# Altium schematic sheet AC6901Demo0.SchDoc
size A4; SheetNumber: 1; SheetTotal: 2
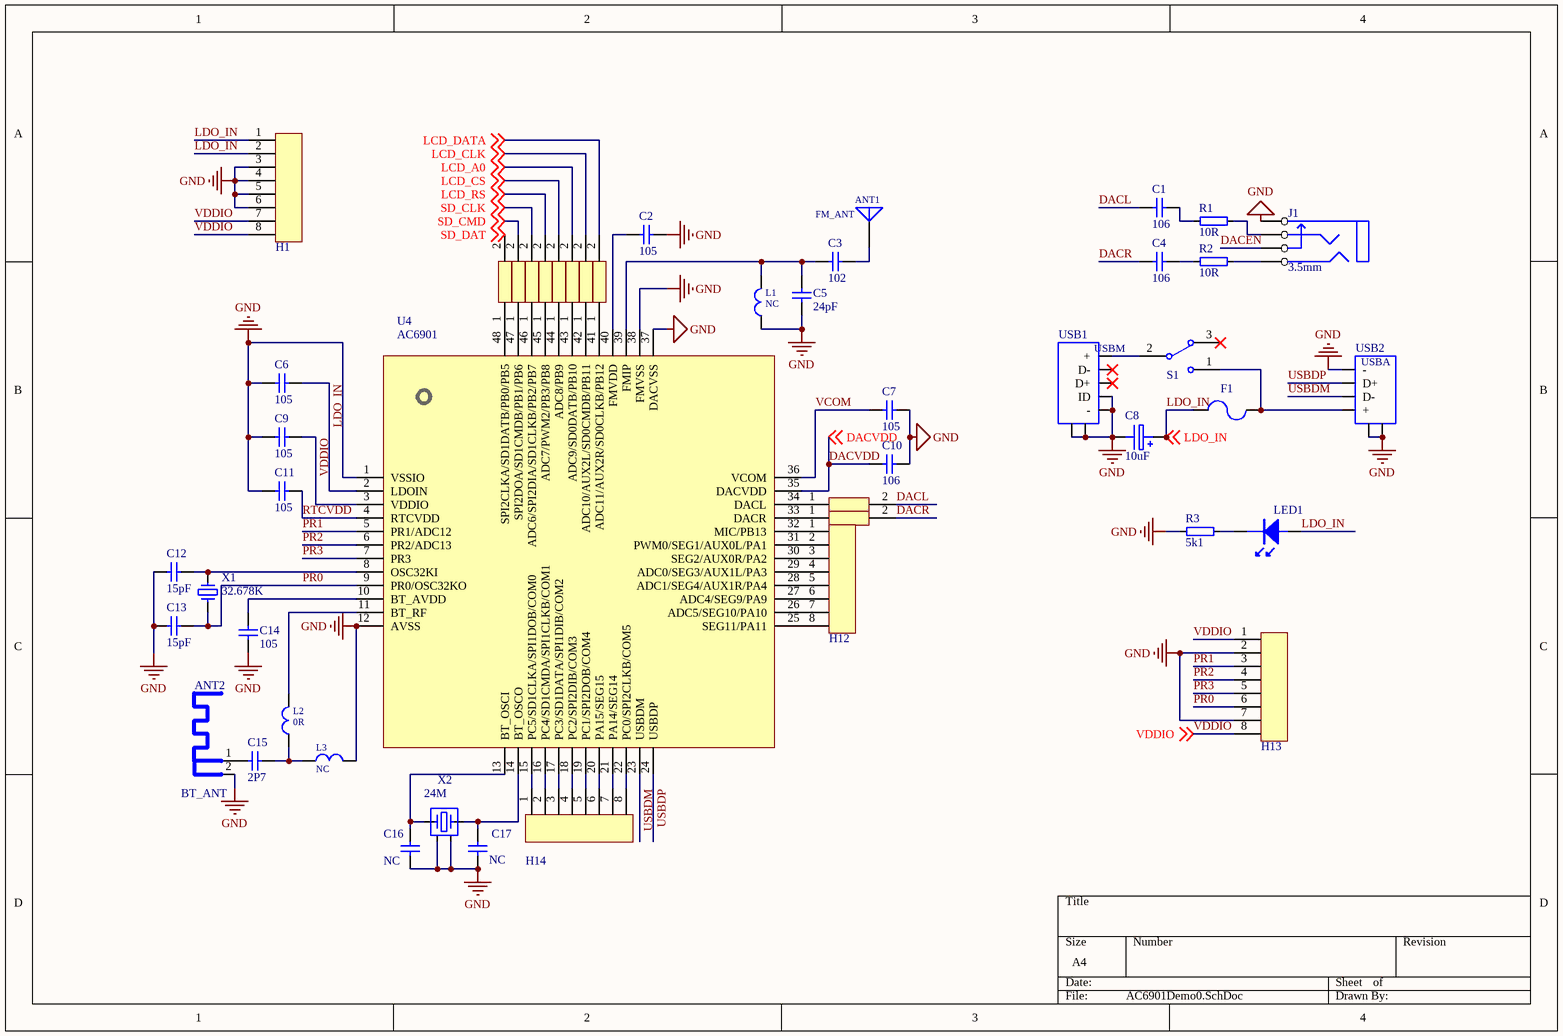
[diagram p0: AC6901Demo0.SchDoc]

## Parts
ANT1  FM_ANT  [FM_ANT]
ANT2  BT_ANT  [ANT-F-2-2.4G]
C1  106  [C 0805]
C2  105  [C 0805]
C3  102  [C 0805]
C4  106  [C 0805]
C5  24pF  [C 0805]
C6  105  [C 0805]
C7  105  [C 0805]
C8  10uF  [CTan(6032)]
C9  105  [C 0805]
C10  106  [C 0805]
C11  105  [C 0805]
C12  15pF  [C 0805]
C13  15pF  [C 0805]
C14  105  [C 0805]
C15  2P7  [C 0805]
C16  NC  [C 0805]
C17  NC  [C 0805]
F1  FUSE  [F1808]  (value not drawn)
H1  HDR1X8  [HDR1X8]  (value not drawn)
H2  HDR2X1  [HDR2X1]  (value not drawn)
H3  HDR2X1  [HDR2X1]  (value not drawn)
H4  HDR2X1  [HDR2X1]  (value not drawn)
H5  HDR2X1  [HDR2X1]  (value not drawn)
H6  HDR2X1  [HDR2X1]  (value not drawn)
H7  HDR2X1  [HDR2X1]  (value not drawn)
H8  HDR2X1  [HDR2X1]  (value not drawn)
H9  HDR2X1  [HDR2X1]  (value not drawn)
H10  HDR2X1  [HDR2X1]  (value not drawn)
H11  HDR2X1  [HDR2X1]  (value not drawn)
H12  HDR1X8  [HDR1X8]  (value not drawn)
H13  HDR1X8  [HDR1X8]  (value not drawn)
H14  HDR1X8  [HDR1X8]  (value not drawn)
J1  3.5mm  [AUX-3.5]
L1  NC  [L 0805]
L2  0R  [L 0805]
L3  NC  [L 0805]
LED1  LED  [LED 0805B]  (value not drawn)
R1  10R  [R 0805]
R2  10R  [R 0805]
R3  5k1  [R 0805]
S1  SW-SPDT  [MSK-12C01-07]  (value not drawn)
U4  AC6901  [LQPF48]
USB1  USBmirco  [USB_micro]  (value not drawn)
USB2  USBA  [USB-A]  (value not drawn)
X1  32.678K  [XTAL_3X8]
X2  24M  [XTAL_3225-4P]

## Nets
GND: ANT2.2 C2.1 C5.2 C6.2 C7.2 C8.2 C9.2 C10.2 C11.2 C12.1 C13.1 C14.1 C16.2 C17.1 H1.3 H1.4 H1.5 H1.6 H13.2 H13.7 J1.1 L1.1 L3.2 R3.1 U4.1(VSSIO) U4.12(AVSS) U4.37(DACVSS) U4.38(FMVSS) USB1.4(ID) USB1.5(-) USB1.GND USB2.4(-) USB2.5(GND) X2.2 X2.4
DACEN: J1.4
DACL: C1.1 H10.2
DACR: C4.1 H11.2
DACVDD: C10.1 U4.35(DACVDD) ; off-sheet DACVDD
LCD_A0: H7.2 ; off-sheet LCD_A0
LCD_CLK: H8.2 ; off-sheet LCD_CLK
LCD_CS: H6.2 ; off-sheet LCD_CS
LCD_DATA: H9.2 ; off-sheet LCD_DATA
LCD_RS: H5.2 ; off-sheet LCD_RS
LDO_IN: C6.1 C8.1 F1.1 H1.1 H1.2 LED1.1 U4.2(LDOIN) ; off-sheet LDO_IN
PR0: C13.2 H13.6 U4.9(PR0/OSC32KO) X1.2
PR1: H13.3 U4.5(PR1/ADC12)
PR2: H13.4 U4.6(PR2/ADC13)
PR3: H13.5 U4.7(PR3)
RTCVDD: C11.1 U4.4(RTCVDD)
SD_CLK: H4.2 ; off-sheet SD_CLK
SD_CMD: H3.2 ; off-sheet SD_CMD
SD_DAT: H2.2 ; off-sheet SD_DAT
USBDM: U4.23(USBDM) USB2.2(D-)
USBDP: U4.24(USBDP) USB2.3(D+)
VCOM: C7.1 U4.36(VCOM)
VDDIO: C9.1 H1.7 H1.8 H13.1 H13.8 U4.3(VDDIO) ; off-sheet VDDIO
NetANT1_1: ANT1.1 C3.2
NetANT2_1: ANT2.1 C15.1
NetC1_2: C1.2 R1.1
NetC2_2: C2.2 U4.40(FMVDD)
NetC3_1: C3.1 C5.1 L1.2 U4.39(FMIP)
NetC4_2: C4.2 R2.1
NetC12_2: C12.2 U4.8(OSC32KI) X1.1
NetC14_2: C14.2 U4.10(BT_AVDD)
NetC15_2: C15.2 L2.1 L3.1
NetC16_1: C16.1 U4.13(BT_OSCI) X2.3
NetC17_2: C17.2 U4.14(BT_OSCO) X2.1
NetF1_2: F1.2 S1.1 USB2.1(+)
NetH2_1: H2.1 U4.48(SPI2CLKA/SD1DATB/PB0/PB5)
NetH3_1: H3.1 U4.47(SPI2DOA/SD1CMDB/PB1/PB6)
NetH4_1: H4.1 U4.46(ADC6/SPI2DIA/SD1CLKB/PB2/PB7)
NetH5_1: H5.1 U4.45(ADC7/PWM2/PB3/PB8)
NetH6_1: H6.1 U4.44(ADC8/PB9)
NetH7_1: H7.1 U4.43(ADC9/SD0DATB/PB10)
NetH8_1: H8.1 U4.42(ADC10/AUX2L/SD0CMDB/PB11)
NetH9_1: H9.1 U4.41(ADC11/AUX2R/SD0CLKB/PB12)
NetH10_1: H10.1 U4.34(DACL)
NetH11_1: H11.1 U4.33(DACR)
NetH12_1: H12.1 U4.32(MIC/PB13)
NetH12_2: H12.2 U4.31(PWM0/SEG1/AUX0L/PA1)
NetH12_3: H12.3 U4.30(SEG2/AUX0R/PA2)
NetH12_4: H12.4 U4.29(ADC0/SEG3/AUX1L/PA3)
NetH12_5: H12.5 U4.28(ADC1/SEG4/AUX1R/PA4)
NetH12_6: H12.6 U4.27(ADC4/SEG9/PA9)
NetH12_7: H12.7 U4.26(ADC5/SEG10/PA10)
NetH12_8: H12.8 U4.25(SEG11/PA11)
NetH14_1: H14.1 U4.15(PC5/SD1CLKA/SPI1DOB/COM0)
NetH14_2: H14.2 U4.16(PC4/SD1CMDA/SPI1CLKB/COM1)
NetH14_3: H14.3 U4.17(PC3/SD1DATA/SPI1DIB/COM2)
NetH14_4: H14.4 U4.18(PC2/SPI2DIB/COM3)
NetH14_5: H14.5 U4.19(PC1/SPI2DOB/COM4)
NetH14_6: H14.6 U4.20(PA15/SEG15)
NetH14_7: H14.7 U4.21(PA14/SEG14)
NetH14_8: H14.8 U4.22(PC0/SPI2CLKB/COM5)
NetJ1_2: J1.2 R1.2
NetJ1_3: J1.3 R2.2
NetL2_2: L2.2 U4.11(BT_RF)
NetLED1_2: LED1.2 R3.2
NetS1_2: S1.2 USB1.1(+)

Not connected (* = marked no-connect by the designer): S1 3*; USB1 2(D-)* 3(D+)*

## Notes on the sheet
- (in symbol USBmirco) USBM

## Library data of the parts
C1-C7 C9-C17 = CAP-MLCC
C8 = CAP-ALE
J1 = 立体声插头
L1-L3 = INDUCTOR
R1-R3 = RES
X1 = XTAL_3X8
X2 = XTAL_3325-4
S1 = SW-SPDT: Published: 24-Mar-1999; LatestRevisionDate: 17-Dec-2003; LatestRevisionNote: Schematic revised, PCB Footprint replaced.; DatasheetDocument: 05-Dec-2000; PackageReference: TL36WW15050; Publisher: Altium Limited; ComponentLink1Description: Manufacturer Link; ComponentLink1URL: http://www.apem.com